# EAGLE design sensor_board_27-05 (EAGLE 7.2.0)
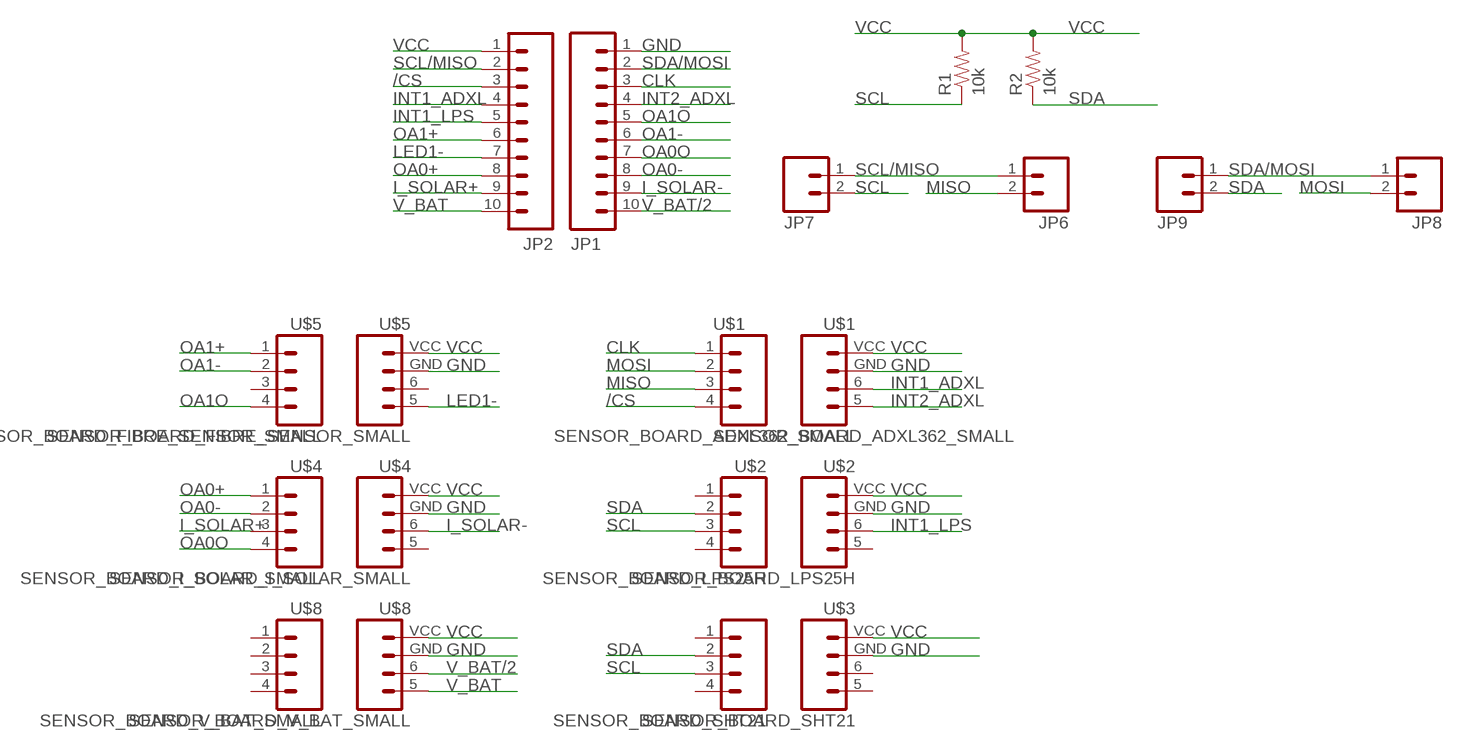
[diagram p0: schematic, sheet 1]

## Parts
JP1  M10SILK_FEMALE_PTH  [1X10]
JP2  M10SILK_FEMALE_PTH  [1X10]
JP6  M02PTH  [1X02]
JP7  M02PTH  [1X02]
JP8  M02PTH  [1X02]
JP9  M02PTH  [1X02]
R1  10k  10KOHM-1/4W-1%(PTH)HORIZ  [AXIAL-0.3]
R2  10k  10KOHM-1/4W-1%(PTH)HORIZ  [AXIAL-0.3]
U$1  SENSOR_BOARD_ADXL362_SMALL  [SENSOR_BOARD_GEN_SMALL]
U$2  SENSOR_BOARD_LPS25H  [SENSOR_BOARD_GEN]
U$3  SENSOR_BOARD_SHT21  [SENSOR_BOARD_GEN]
U$4  SENSOR_BOARD_I_SOLAR_SMALL  [SENSOR_BOARD_GEN_SMALL]
U$5  SENSOR_BOARD_FIBRE_SENSOR_SMALL  [SENSOR_BOARD_GEN_SMALL]
U$8  SENSOR_BOARD_V_BAT_SMALL  [SENSOR_BOARD_GEN_SMALL]

## Nets
/CS: JP2.3 U$1.4(/CS)
CLK: JP1.3 U$1.1(CLK)
GND: JP1.1 U$1.GND U$2.GND U$3.GND U$4.GND U$5.GND U$8.GND
I_SOLAR+: JP2.9 U$4.3(I_SOLAR+)
I_SOLAR-: JP1.9 U$4.6(I_SOLAR-)
INT1_ADXL: JP2.4 U$1.6(INT1)
INT1_LPS: JP2.5 U$2.6(INT1)
INT2_ADXL: JP1.4 U$1.5(INT2)
LED1-: JP2.7 U$5.5(LED-)
MISO: JP6.2 U$1.3(MISO)
MOSI: JP8.2 U$1.2(MOSI)
OA0+: JP2.8 U$4.1(OA+)
OA0-: JP1.8 U$4.2(OA-)
OA0O: JP1.7 U$4.4(OAO)
OA1+: JP2.6 U$5.1(OA+)
OA1-: JP1.6 U$5.2(OA-)
OA1O: JP1.5 U$5.4(OAO)
SCL: JP7.2 R1.P$1 U$2.3(SCL) U$3.3(SCL)
SCL/MISO: JP2.2 JP6.1 JP7.1
SDA: JP9.2 R2.P$1 U$2.2(SDA) U$3.2(SDA)
SDA/MOSI: JP1.2 JP8.1 JP9.1
V_BAT: JP2.10 U$8.5(V_BAT)
V_BAT/2: JP1.10 U$8.6(V_BAT/2)
VCC: JP2.1 R1.P$2 R2.P$2 U$1.VCC U$2.VCC U$3.VCC U$4.VCC U$5.VCC U$8.VCC
Unconnected: U$2.1 U$2.4 U$2.5 U$3.1 U$3.4 U$3.5 U$3.6 U$4.5 U$5.3 U$5.6 U$8.1 U$8.2 U$8.3 U$8.4

## Library data of the parts
JP1 JP2 = SparkFun-Connectors:M10: Header 10 Standard 10-pin 0.1" header. Use with straight break away headers (SKU : PRT-00116), right angle break away headers (PRT-00553), swiss pins (PRT-00743), machine pins (PRT-00117), and female headers (PRT-00115).; PROD_ID: CONN-11563
JP6-JP9 = SparkFun-Connectors:M02: Standard 2-pin 0.1" header. Use with - straight break away headers ( PRT-00116) - right angle break away headers (PRT-00553) - swiss pins (PRT-00743) - machine pins (PRT-00117) - female headers (PRT-00115) Molex polarized connector foot print use with: PRT-08233 with associated crimp pins and housings. 2.54_SCREWTERM for use with PRT-10571. 3.5mm Screw Terminal footprints for PRT-08084 5mm Screw Terminal footprints for use with PRT-08432
R1 R2 = SparkFun-Resistors:10KOHM-1/4W-1%(PTH): RES-12183; PROD_ID: RES-12183
U$1 = sensors:SENSOR_BOARD_ADXL362
U$2 = sensors:SENSOR_BOARD_LPS25H
U$3 = sensors:SENSOR_BOARD_SHT21
U$4 = sensors:SENSOR_BOARD_I_SOLAR
U$5 = sensors:SENSOR_BOARD_FIBRE_SENSOR
U$8 = sensors:SENSOR_BOARD_V_BAT

## Board
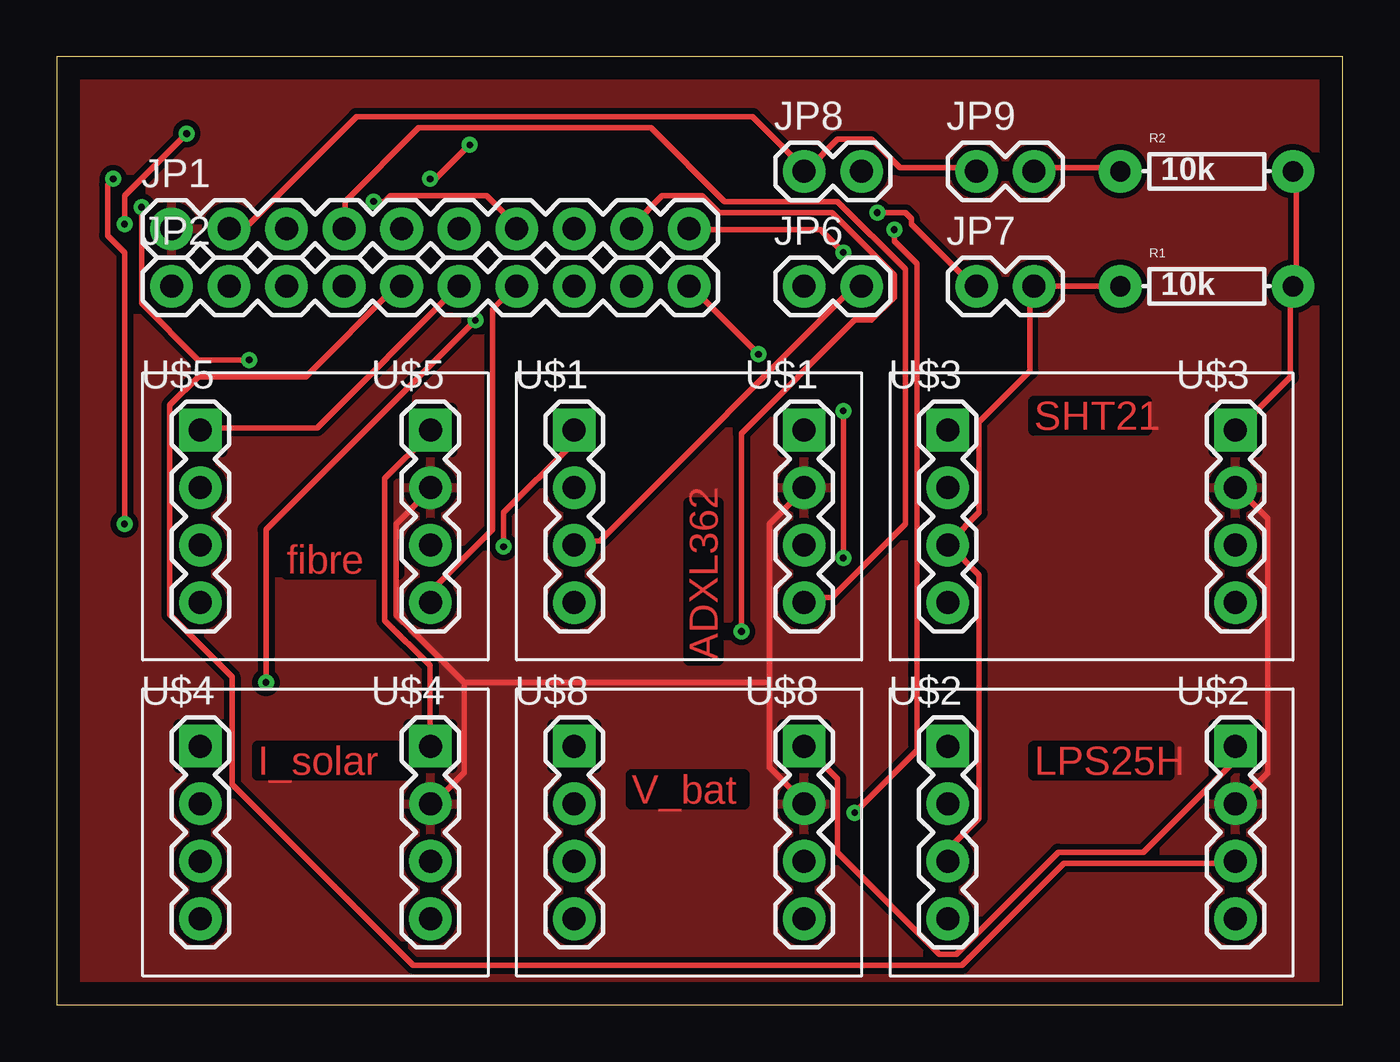
[diagram p1: board, top side]
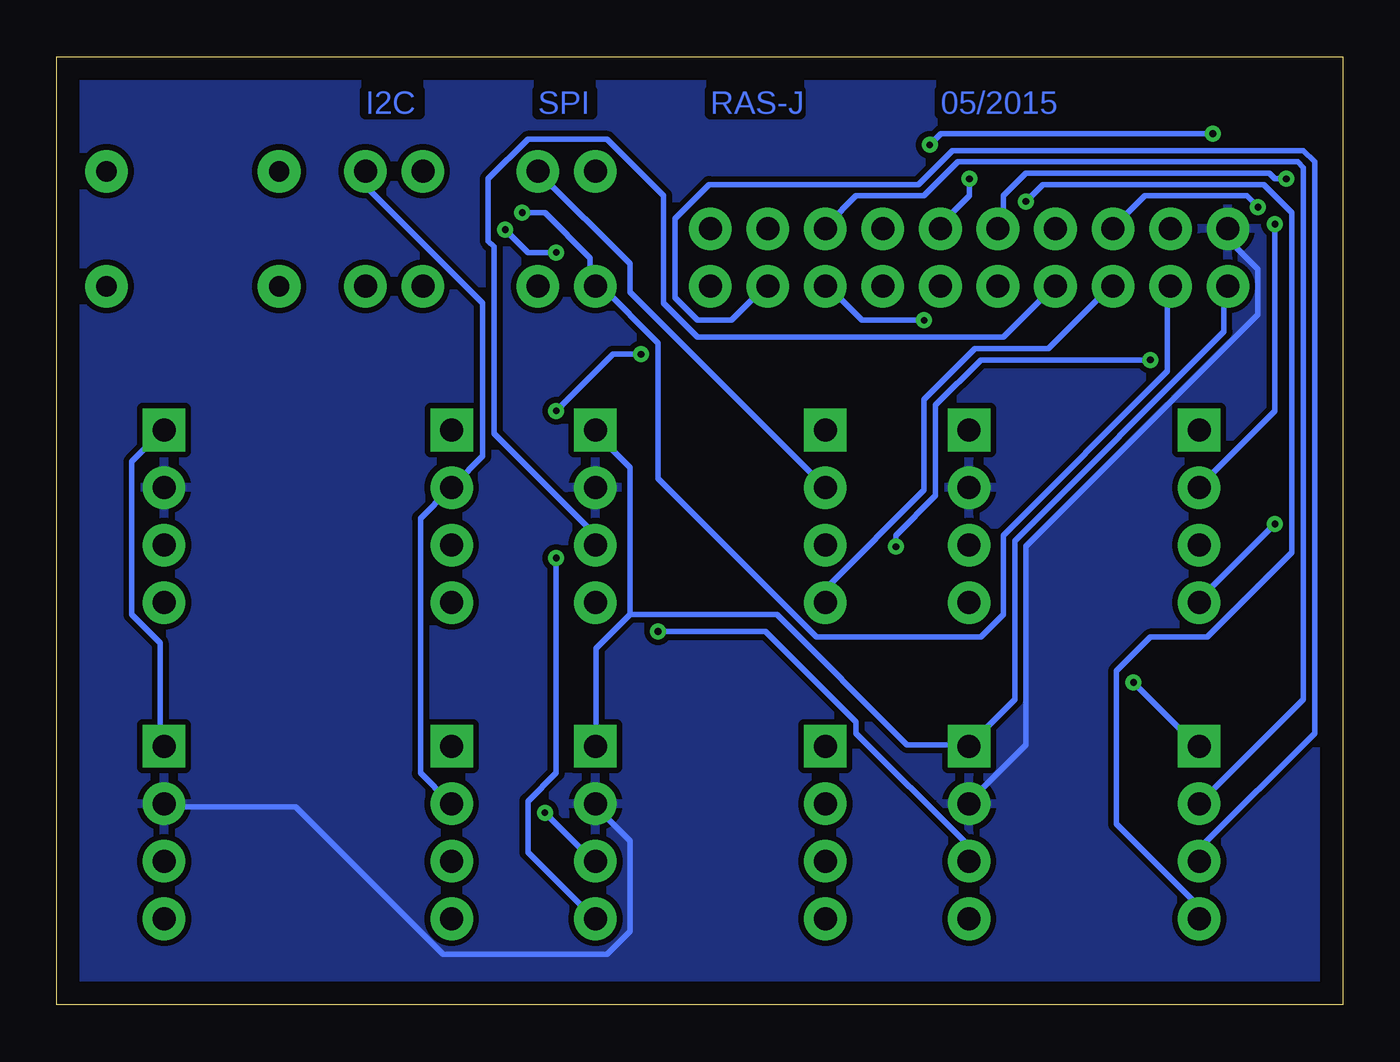
[diagram p2: board, bottom side, seen from below]

Size 56.82 x 41.9 mm. Coordinates in mm from the lower left corner, seen from the top.
Outline: 0,0 56.82,0 56.82,41.9 0,41.9 0,0
Copper layers (1*16): Top 0.035mm / dielectric 1.5mm / Bottom 0.035mm
Design rules "UoM_design_rules": minimum track width 0.25mm, minimum drill 0.3mm, track to track 0.25mm, track to pad 0.25mm, pad to pad 0.25mm, via to via 0.25mm, smd to smd 8mil, copper to edge 40mil, drill to drill 8mil, minimum pad ring 10mil, minimum via ring 8mil, stop-mask expansion 4mil, vias tented up to drill 0mil, thermal gap 10mil

### Footprints (pad centres in the part's own frame; a part is rotated, then mirrored left to right if it is on the bottom)
1X10 = drill 1.016 pad 1.88: 1 0,0; 2 2.54,0; 3 5.08,0; 4 7.62,0; 5 10.16,0; 6 12.7,0; 7 15.24,0; 8 17.78,0; 9 20.32,0; 10 22.86,0
1X02 = drill 1.016 pad 1.88: 1 0,0; 2 2.54,0
AXIAL-0.3 = drill 0.9 pad 1.88: P$1 -3.81,0; P$2 3.81,0
SENSOR_BOARD_GEN_SMALL = drill 1.016 pad 1.88 square: 1 2.54,10.16; VCC 12.7,10.16 | drill 1.016 pad 1.88: 2 2.54,7.62; 3 2.54,5.08; 4 2.54,2.54; 5 12.7,2.54; 6 12.7,5.08; GND 12.7,7.62
SENSOR_BOARD_GEN = drill 1.016 pad 1.88 square: 1 2.54,10.16; VCC 15.24,10.16 | drill 1.016 pad 1.88: 2 2.54,7.62; 3 2.54,5.08; 4 2.54,2.54; 5 15.24,2.54; 6 15.24,5.08; GND 15.24,7.62

### Placement (x,y rotation side)
JP1  5.08,34.29 0 top
JP2  5.08,31.75 0 top
JP6  33.02,31.75 0 top
JP7  40.64,31.75 0 top
JP8  33.02,36.83 0 top
JP9  40.64,36.83 0 top
R1  50.8,31.75 0 top
R2  50.8,36.83 0 top
U$1  20.32,15.24 0 top
U$2  36.83,1.27 0 top
U$3  36.83,15.24 0 top
U$4  3.81,1.27 0 top
U$5  3.81,15.24 0 top
U$8  20.32,1.27 0 top

### Tracks (layer width: path | path; a pad name or v marks a point on that pad's centre or on a via)
/CS
  Bottom 0.25: U$1.4 22.75,18 22.75,18.5 18.5,22.75 18.5,26.75 16.25,29 13,29 10.25,31.75 JP2.3
CLK  (via drill 0.3)
  Top 0.25: v19.75,20.25 19.75,21.75 22.75,24.75 22.75,25.25 U$1.1 | v8.5,28.5 6.25,28.5 3.75,31 v3.75,35.25
  Bottom 0.25: v19.75,20.25 19.75,20.75 18,22.5 18,26.5 16,28.5 v8.5,28.5 | v3.75,35.25 4.25,35.75 8.75,35.75 10,34.5 JP1.3
GND
  Top 0.25: U$2.GND 52.25,9 53.5,10.25 53.5,21.5 52.25,22.75 U$3.GND | 31.5,14.25 31.5,21.25 33,22.75 U$1.GND | 31.5,14.25 31.5,10.5 33,9 U$8.GND | 18,14.25 18,10.25 16.75,9 U$4.GND | 18,14.25 15,17.25 15,21.25 16.5,22.75 U$5.GND | 18,14.25 31.5,14.25
  Bottom 0.25: JP1.1 5,34.25 5,33.75 3.75,32.5 3.75,30.5 14,20.25 14,11.5 16.5,9 U$4.GND | U$2.GND 52,8.75 46.25,8.75 39.75,2.25 32.5,2.25 31.5,3.25 31.5,7.25 33,8.75 U$8.GND
  pour Bottom: 0,41.91 57.15,41.91 57.15,0 0,0
  pour Top: 0,41.91 57.15,41.91 57.15,0 0,0
I_SOLAR+
  Bottom 0.25: U$4.3 6.25,6.5 6.25,7 1.25,12 1.25,37.25 1.75,37.75 17.25,37.75 18.75,36.25 28,36.25 29.5,34.75 29.5,31.25 28.5,30.25 27,30.25 25.5,31.75 JP2.9
I_SOLAR-  (via drill 0.3)
  Top 0.25: v30.25,16.5 30.25,25.25 35.25,30.25 36,30.25 37,31.25 37,32.25 34.25,35 29.25,35 28.5,35.75 26.75,35.75 25.5,34.5 JP1.9
  Bottom 0.25: v30.25,16.5 25.5,16.5 21.5,12.5 21.5,12 16.75,7.25 16.75,6.5 U$4.6
INT1_ADXL
  Bottom 0.25: U$1.6 33.25,20.5 33.25,21 37.5,25.25 37.5,33.5 37.75,33.75 37.75,36.5 36,38.25 32.5,38.25 30,35.75 30,31 28.5,29.5 15,29.5 12.75,31.75 JP2.4
INT1_LPS
  Top 0.25: U$2.6 52,6.25 44.5,6.25 40,1.75 15.75,1.75 7.75,9.75 7.75,14.5 5,17.25 5,26.5 6.25,27.75 11,27.75 15,31.75 JP2.5
INT2_ADXL
  Top 0.25: U$1.5 33.25,18 34.25,18 37.5,21.25 37.5,32.5 34.5,35.5 29.5,35.5 26.25,38.75 16,38.75 12.75,35.5 12.75,34.5 JP1.4
LED1-
  Top 0.25: U$5.5 16.75,18 16.75,18.5 19.25,21 19.25,30.75 20.25,31.75 JP2.7
MISO
  Top 0.25: JP6.2 35.25,31.75 24,20.5 23,20.5 U$1.3
MOSI
  Bottom 0.25: U$1.2 31.5,31.5 31.5,32.75 35.5,36.75 JP8.2
OA0+  (via drill 0.3)
  Top 0.25: v9.25,14.25 9.25,21 v18.5,30.25
  Bottom 0.25: v9.25,14.25 6.5,11.5 U$4.1 | v18.5,30.25 21.25,30.25 22.75,31.75 JP2.8
OA0-
  Bottom 0.25: U$4.2 6.25,9 1.75,13.5 1.75,37 2,37.25 17,37.25 18.5,35.75 21.5,35.75 22.75,34.5 JP1.8
OA0O  (via drill 0.3)
  Top 0.25: v14,35.5 14.5,35.5 14.75,35.75 19,35.75 20.25,34.5 JP1.7
  Bottom 0.25: v14,35.5 13.25,36.25 3.5,36.25 2.25,35 2.25,20 6,16.25 8.5,16.25 10,14.75 10,8 6.5,4.5 6.5,4 U$4.4
OA1+
  Top 0.25: U$5.1 6.5,25.5 11.5,25.5 17.75,31.75 JP2.6
OA1-  (via drill 0.3)
  Top 0.25: v3,34.5 3,35.75 v5.75,38.5 | v18.25,38 16.75,36.5 v16.5,36.5
  Bottom 0.25: v3,34.5 3,26.25 6.25,23 U$5.2 | v5.75,38.5 17.75,38.5 v18.25,38 | v16.5,36.5 16.5,35.75 17.75,34.5 JP1.6
OA1O  (via drill 0.3)
  Top 0.25: v3,21.25 3,33.25 2.25,34 2.25,36.25 v2.5,36.5
  Bottom 0.25: v3,21.25 6.25,18 U$5.4 | v2.5,36.5 3,36.5 3.25,36.75 14,36.75 15,35.75 15,34.5 JP1.5
SCL
  Top 0.25: R1.P$1 JP7.2 43,31.75 43,28 40.75,25.75 40.75,21.75 39.5,20.5 U$3.3 39.5,20.25 40.75,19 40.75,8.25 39.5,7 39.5,6.5 U$2.3
SCL/MISO  (via drill 0.3)
  Top 0.25: v36.25,35 37.5,35 37.75,34.75 37.75,34.5 40.5,31.75 JP7.1
  Bottom 0.25: JP2.2 7.75,31.75 7.75,28 15,20.75 15,17.25 16,16.25 23.25,16.25 30.25,23.25 30.25,29.25 32.75,31.75 JP6.1 33.25,31.75 33.25,33 35.25,35 v36.25,35
SDA
  Top 0.25: JP9.2 43.25,37 46.75,37 R2.P$1
  Bottom 0.25: U$2.2 39.5,9 40.75,10.25 40.75,21.5 39.5,22.75 U$3.2 39.25,23 38,24.25 38,31 43,36 43,36.75 JP9.2
SDA/MOSI
  Top 0.25: JP1.2 7.75,34.5 8.5,34.5 13.25,39.25 30.75,39.25 33,37 JP8.1 33.25,37 34.5,38.25 36,38.25 37.25,37 40.5,37 JP9.1
V_BAT  (via drill 0.3)
  Top 0.25: v31,28.75 28,31.75 JP2.10 | v34.75,19.75 v34.75,26.25
  Bottom 0.25: v31,28.75 32.25,28.75 v34.75,26.25 | v34.75,19.75 34.75,10.25 36,9 36,6.75 33.25,4 U$8.5
V_BAT/2  (via drill 0.3)
  Top 0.25: v34.75,33.25 33.75,34.25 28,34.25 JP1.10 | v37,34.25 37,33.75 38,32.75 38,11.25 v35.25,8.5
  Bottom 0.25: v34.75,33.25 36,33.25 v37,34.25 | v35.25,8.5 33.25,6.5 U$8.6
VCC
  Top 0.25: R2.P$2 54.75,36.75 54.75,31.75 R1.P$2 54.5,31.75 54.5,27.75 52.25,25.5 U$3.VCC | U$4.VCC 16.5,11.5 16.5,15 14.5,17 14.5,23.25 16.5,25.25 U$5.VCC | U$2.VCC 52,11.25 52,10.75 48,6.75 44.25,6.75 39.75,2.25 39,2.25 34.5,6.75 34.5,10 33.25,11.25 U$8.VCC
  Bottom 0.25: U$2.VCC 52.25,11.5 52.25,16 53.5,17.25 53.5,24 52.25,25.25 U$3.VCC | 31.5,17.25 33,15.75 33,11.5 U$8.VCC | 31.5,17.25 31.5,23.75 33,25.25 U$1.VCC | JP2.1 5.25,31.75 5.25,29.75 14.5,20.5 14.5,13.5 16.5,11.5 U$4.VCC 16.75,11.5 19.25,11.5 25,17.25 31.5,17.25

### Text on the board
Top: SHT21 | fibre | ADXL362 | I_solar | LPS25H | V_bat
Bottom: 05/2015 | RAS-J | SPI | I2C